# Altium project 09-BluetoothHC05.PrjPcb
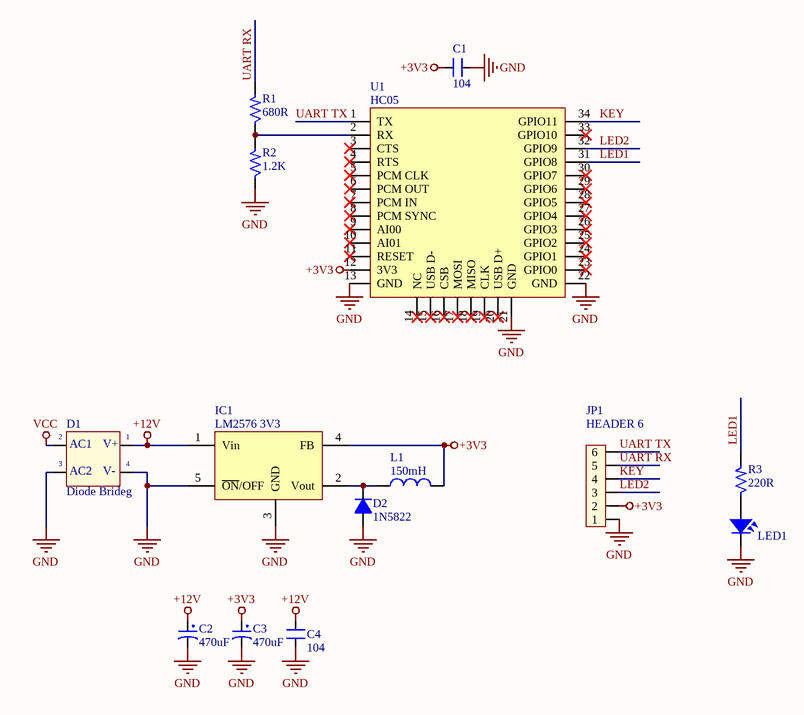
[diagram p0: 09-BluetoothHC05.SchDoc]
1 sheet, 14 parts. Net scope: global (net labels, ports and power ports of the same name join across sheets).
Board file: 09-BluetoothHC05.PcbDoc

## Sheet 09-BluetoothHC05.SchDoc
size A

### Parts
C1  104  [C-0805]
C2  470uF  [C-TANT-7343-31-CASEA]
C3  470uF  [C-TANT-7343-31-CASEA]
C4  104  [C-0805]
D1  Diode Brideg  [D-DB-1A-SMD]
D2  1N5822  [D-DO214-AB]
IC1  LM2576 3V3  [TO-263-5L]
JP1  HEADER 6  [JP6]
L1  150mH  [L-SMD-10x10]
LED1  LED  [LED-0805]  (value not drawn)
R1  680R  [R-0805]
R2  1.2K  [R-0805]
R3  220R  [R-0805]
U1  HC05  [LV-BC-2.0]

### Nets
+3V3: C1.2 C3.1 IC1.4(FB) JP1.2 L1.2 U1.12(3V3)
+12V: C2.1 C4.2 D1.3(AC2) IC1.1(Vin)
GND: C1.1 C2.2 C3.2 C4.1 D1.1(+V_OUT) D1.4(-V_OUT) D2.1(A) IC1.3(GND) IC1.5(~{ON}/OFF) IC1.HM(GND) JP1.1 LED1.2 R2.1 U1.13(GND) U1.21(GND) U1.22(GND)
VCC: D1.2(AC1)
KEY: JP1.4 U1.34(GPIO11)
LED1: R3.2 U1.31(GPIO8)
LED2: JP1.3 U1.32(GPIO9)
UART RX: JP1.5 R1.2
UART TX: JP1.6 U1.1(TX)
NetD2_2: D2.2(K) IC1.2(Vout) L1.1
NetLED1_1: LED1.1 R3.1
NetR1_1: R1.1 R2.2 U1.2(RX)

Not connected (* = marked no-connect by the designer): U1 3(CTS)* 4(RTS)* 5(PCM_CLK)* 6(PCM_OUT)* 7(PCM_IN)* 8(PCM_SYNC)* 9(AI00)* 10(AI01)* 11(RESET)* 14(NC)* 15(USB_D-)* 16(CSB)* 17(MOSI)* 18(MISO)* 19(CLK)* 20(USB_D+)* 23(GPIO0)* 24(GPIO1)* 25(GPIO2)* 26(GPIO3)* 27(GPIO4)* 28(GPIO5)* 29(GPIO6)* 30(GPIO7)* 33(GPIO10)*

### Notes on the sheet
- (in symbol DB) V+; V-

### Library data of the parts
C1 C4 = CN: Value: 0,1uF/300V; Designed by: VanDungEvn
C2 C3 = CP1: Cap P  0,1uF < 22uF , 16 - 50V; Value: 10uF/50V; Description 1: 10 => 220uF/6,3V/10V - 10uF => 100uF/16V; Description 2: 0,1uF => 33uF/50V - 10uF => 22uF/63V; Description 3: 0,47uF => 10uF/100V
D1 = DB: Convert AC to DC voltage, 4 pin; Value: Cau 1A
D2 = D1A: Diode 1A; Value: 1N4007
IC1 = LM2576
JP1 = JP6: JP6 PIN; Value: JP7
L1 = L1: Inductor; Value: 150 mH
LED1 = LED: LED Single colour Green and Red; Value: LED 3 ly Single Colour
R1-R3 = R: Resistor 1/4W; Value: R1/4W - 1K
U1 = HC05: Value: HC05